# EAGLE design TCS3200 (EAGLE 7.6.0)
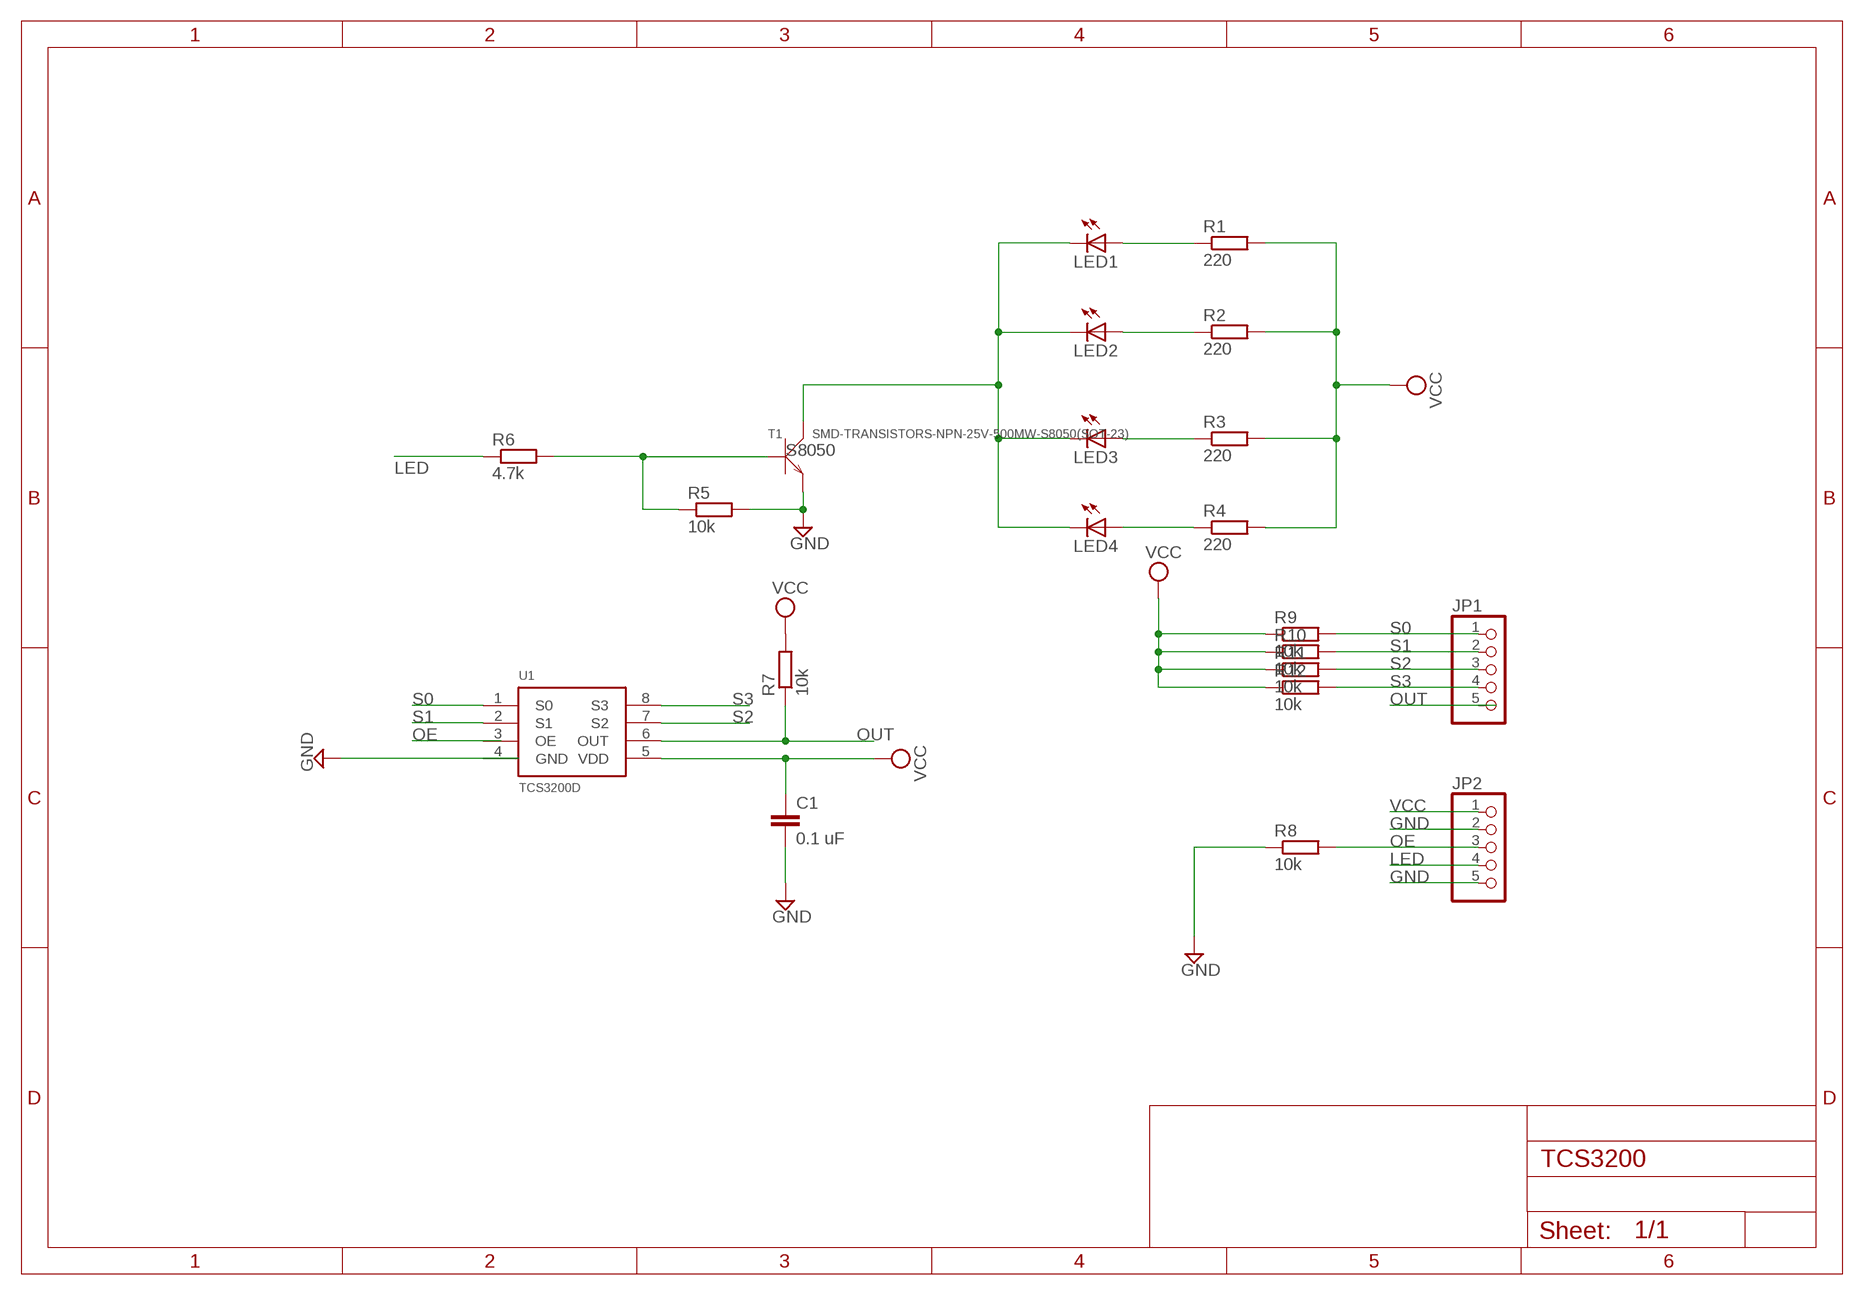
[diagram p0: schematic, sheet 1]

## Parts
C1  0.1 uF  C-EUC3216  [C3216]
JP1  PINHD-1X5/90  [1X05/90]
JP2  PINHD-1X5/90  [1X05/90]
LED1  LEDSML1206  [SML1206]
LED2  LEDSML1206  [SML1206]
LED3  LEDSML1206  [SML1206]
LED4  LEDSML1206  [SML1206]
R1  220  R-EU_R2012W  [R2012W]
R2  220  R-EU_R2012W  [R2012W]
R3  220  R-EU_R2012W  [R2012W]
R4  220  R-EU_R2012W  [R2012W]
R5  10k  R-EU_R2012W  [R2012W]
R6  4.7k  R-EU_R2012W  [R2012W]
R7  10k  R-EU_R2012W  [R2012W]
R8  10k  R-EU_R2012W  [R2012W]
R9  10k  R-EU_R2012W  [R2012W]
R10  10k  R-EU_R2012W  [R2012W]
R11  10k  R-EU_R2012W  [R2012W]
R12  10k  R-EU_R2012W  [R2012W]
T1  SMD-TRANSISTORS-NPN-25V-500MW-S8050(SOT-23)  [SOT-23]
U1  TCS3200D  [SOIC8]

## Nets
GND: C1.2 JP2.2 JP2.5 R5.2 R8.1 T1.2(E)
LED: JP2.4 R6.1
N$1: LED1.A R1.1
N$2: LED2.A R2.1
N$3: LED3.A R3.1
N$4: LED4.A R4.1
N$6: LED1.C LED2.C LED3.C LED4.C T1.3(C)
N$7: R5.1 R6.2 T1.1(B)
OE: JP2.3 R8.2
OUT: R7.1 U1.6(OUT)
S0: JP1.1 R9.2 U1.1(S0)
S1: JP1.2 R10.2
S2: JP1.3 R11.2 U1.7(S2)
S3: JP1.4 R12.2 U1.8(S3)
VCC: C1.1 JP2.1 R1.2 R2.2 R3.2 R4.2 R7.2 R9.1 R10.1 R11.1 R12.1 U1.5(VDD)
Unconnected: JP1.5 U1.2(S1) U1.3(OE) U1.4(GND)

## Library data of the parts
C1 = rcl:C-EU: CAPACITOR, European symbol
JP1 JP2 = pinhead:PINHD-1X5: PIN HEADER
LED1-LED4 = led:LED: LED OSRAM: - CHIPLED LG R971, LG N971, LY N971, LG Q971, LY Q971, LO R971, LY R971 LH N974, LH R974 LS Q976, LO Q976, LY Q976 LO Q996 - Hyper CHIPLED LW Q18S LB Q993, LB Q99A, LB R99A - SideLED LS A670, LO A670, LY A670, LG A670, LP A670 LB A673, LV A673, LT A673, LW A673 LH A674 LY A675 LS A676, LA A676, LO A676, LY A676, LW A676 LS A679, LY A679, LG A679 - Hyper Micro SIDELED® LS Y876, LA Y876, LO Y876, LY Y876 LT Y87S - SmartLED LW L88C, LW L88S LB L89C, LB L89S, LG L890 LS L89K, LO L89K, LY L89K LS L896, LA L896, LO L896, LY L896 - TOPLED LS T670, LO T670, LY T670, LG T670, LP T670 LSG T670, LSP T670, LSY T670, LOP T670, LYG T670 LG T671, LOG T671, LSG T671 LB T673, LV T673, LT T673, LW T673 LH T674 LS T676, LA T676, LO T676, LY T676, LB T676, LH T676, LSB T676, LW T676 LB T67C, LV T67C, LT T67C, LS T67K, LO T67K, LY T67K, LW E67C LS E67B, LA E67B, LO E67B, LY E67B, LB E67C, LV E67C, LT E67C LW T67C LS T679, LY T679, LG T679 LS T770, LO T770, LY T770, LG T770, LP T770 LB T773, LV T773, LT T773, LW T773 LH T774 LS E675, LA E675, LY E675, LS T675 LS T776, LA T776, LO T776, LY T776, LB T776 LHGB T686 LT T68C, LB T68C - Hyper Mini TOPLED® LB M676 - Mini TOPLED Santana® LG M470 LS M47K, LO M47K, LY M47K Source: http://www.osram.convergy.de LUXEON: - LUMILED® LXK2-PW12-R00, LXK2-PW12-S00, LXK2-PW14-U00, LXK2-PW14-V00 LXK2-PM12-R00, LXK2-PM12-S00, LXK2-PM14-U00 LXK2-PE12-Q00, LXK2-PE12-R00, LXK2-PE12-S00, LXK2-PE14-T00, LXK2-PE14-U00 LXK2-PB12-K00, LXK2-PB12-L00, LXK2-PB12-M00, LXK2-PB14-N00, LXK2-PB14-P00, LXK2-PB14-Q00 LXK2-PR12-L00, LXK2-PR12-M00, LXK2-PR14-Q00, LXK2-PR14-R00 LXK2-PD12-Q00, LXK2-PD12-R00, LXK2-PD12-S00 LXK2-PH12-R00, LXK2-PH12-S00 LXK2-PL12-P00, LXK2-PL12-Q00, LXK2-PL12-R00 Source: www.luxeon.com KINGBRIGHT: KA-3528ASYC Source: www.kingbright.com
R1 = rcl:R-EU_: RESISTOR, European symbol; R1: 220
R2-R12 = rcl:R-EU_: RESISTOR, European symbol
T1 = SMD-TRANSISTORS-NPN-25V-500MW-S8050_SOT-23_:SMD-TRANSISTORS-NPN-25V-500MW-S8050(SOT-23): 305010017; AVAILABILITY: Unavailable; DESCRIPTION: SMD Transistors NPN 25V-500mW;; MF: JCET; MP: S8050; PACKAGE: SOT-23-3 JCET; PRICE: None
U1 = TCS3200D:TCS3200D; AVAILABILITY: Unavailable; DESCRIPTION: Sensor, Light and Colour to Frequency; MF: RS Components; MP: TCS3200D; PACKAGE: None; PRICE: None

## Board
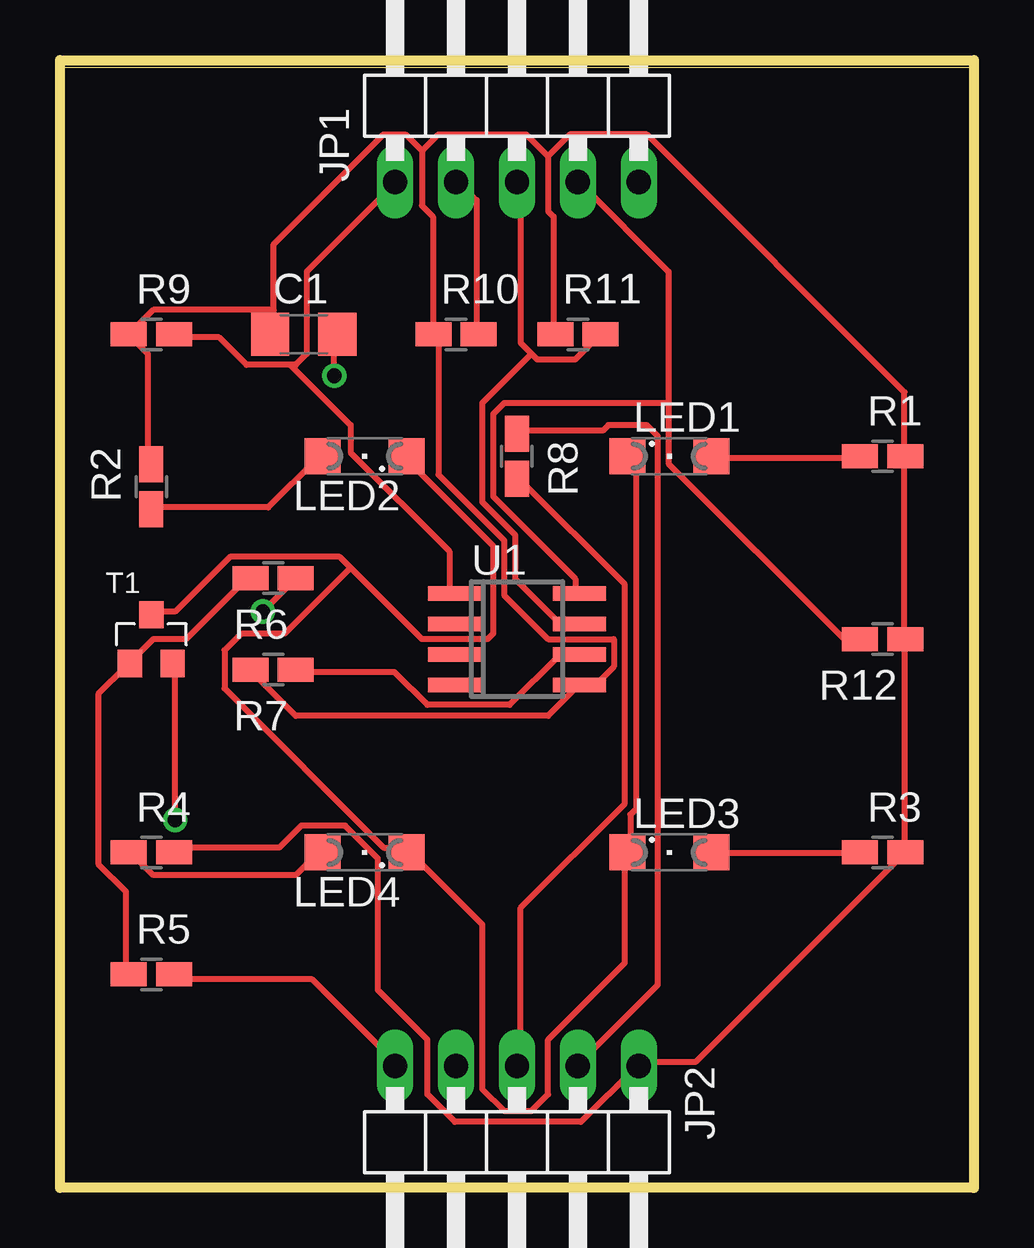
[diagram p1: board, top side]
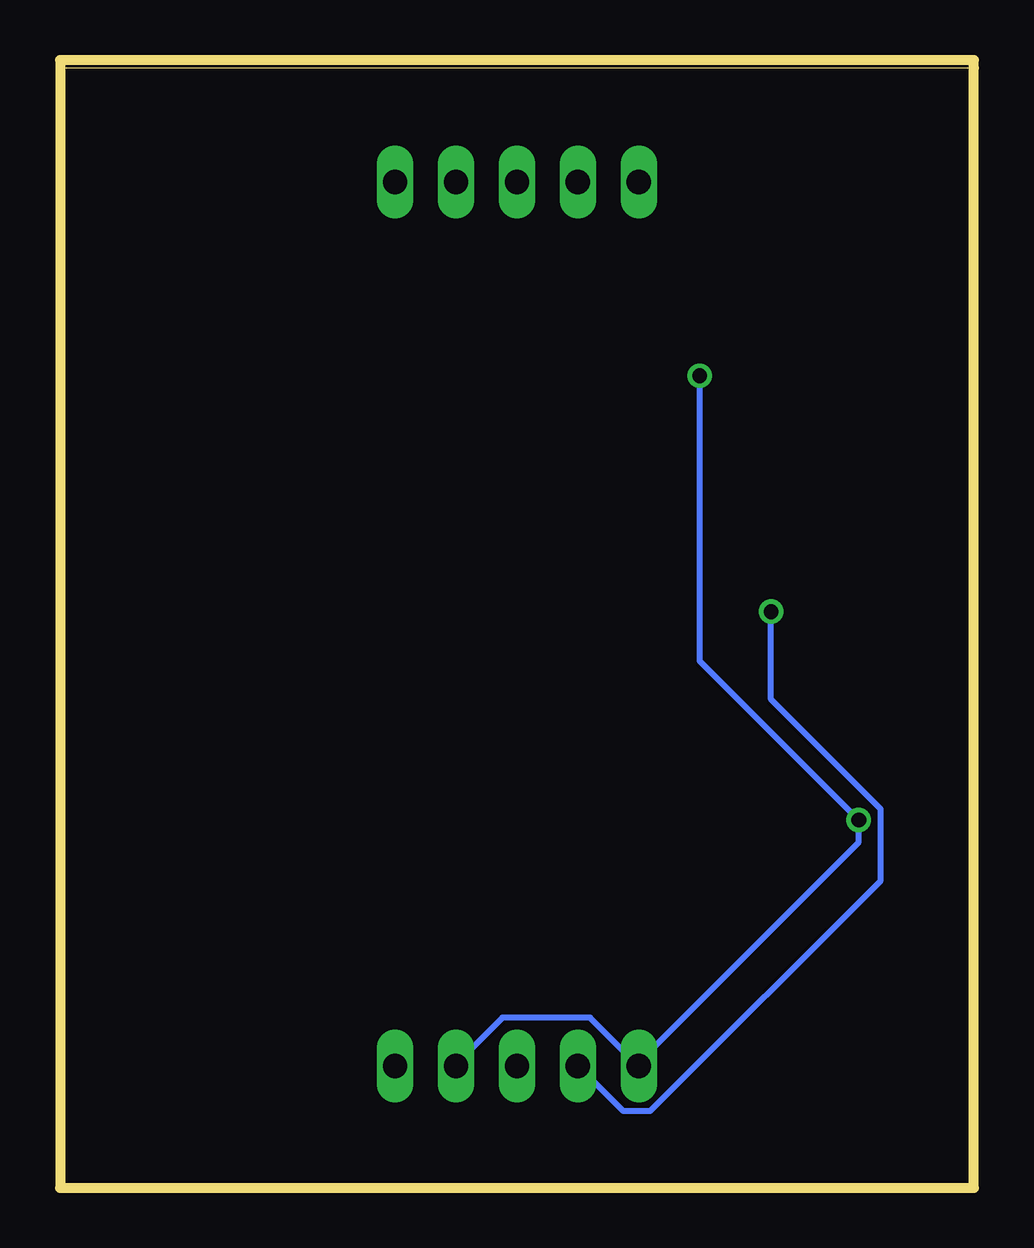
[diagram p2: board, bottom side, seen from below]

Size 38.1 x 46.99 mm. Coordinates in mm from the lower left corner, seen from the top.
Outline: 38.08,0 38.08,46.66 0,46.66
Outline: 0,46.66 0,0 38.08,0
Outline: 0,46.66 0,46.99 38.1,46.99 38.1,0 38.08,0
Copper layers (1*16): Top 0.035mm / dielectric 1.5mm / Bottom 0.035mm
Design rules "default": minimum track width 10mil, minimum drill 24mil, track to track 8mil, track to pad 8mil, pad to pad 8mil, via to via 8mil, smd to smd 8mil, copper to edge 40mil, drill to drill 8mil, minimum pad ring 10mil, minimum via ring 8mil, stop-mask expansion 4mil, vias tented up to drill 0mil, thermal gap 10mil

### Footprints (pad centres in the part's own frame; a part is rotated, then mirrored left to right if it is on the bottom)
C3216 = smd 1.6 x 1.8: 1 -1.4,0; 2 1.4,0
1X05/90 = drill 1.016 long: 1 -5.08,-3.81; 2 -2.54,-3.81; 3 0,-3.81; 4 2.54,-3.81; 5 5.08,-3.81
SML1206 = smd 1.5 x 1.5: A 1.75,0; C -1.75,0
R2012W = smd 1.5 x 1: 1 -0.94,0; 2 0.94,0
SOT-23 = smd 1.016 x 1.143: 1 -0.889,-1.016; 2 0.889,-1.016; 3 0,1.016
SOIC8 = smd 2.2 x 0.6: 1 -2.6,1.905; 2 -2.6,0.635; 3 -2.6,-0.635; 4 -2.6,-1.905; 5 2.6,-1.905; 6 2.6,-0.635; 7 2.6,0.635; 8 2.6,1.905

### Placement (x,y rotation side)
C1  10.16,35.56 0 top
JP1  19.05,45.72 0 top
JP2  19.05,1.27 180 top
LED1  25.4,30.48 0 top
LED2  12.7,30.48 180 top
LED3  25.4,13.97 0 top
LED4  12.7,13.97 180 top
R1  34.29,30.48 0 top
R2  3.81,29.21 90 top
R3  34.29,13.97 0 top
R4  3.81,13.97 0 top
R5  3.81,8.89 0 top
R6  8.89,25.4 180 top
R7  8.89,21.59 180 top
R8  19.05,30.48 270 top
R9  3.81,35.56 0 top
R10  16.51,35.56 0 top
R11  21.59,35.56 0 top
R12  34.29,22.86 180 top
T1  3.81,22.86 0 top
U1  19.05,22.86 0 top

### Tracks (layer width: path | path; a pad name or v marks a point on that pad's centre or on a via)
GND  (via drill 0.61)
  Top 0.254: R8.1 19.2,31.55 22.63,31.55 22.86,31.77 24.46,31.77 24.92,31.32 24.92,8.46 21.72,5.26 JP2.2 | v4.8,15.32 4.8,21.72 T1.2 | R5.2 4.8,8.69 10.52,8.69 13.95,5.26 JP2.5 | v11.43,33.83 11.43,35.43 C1.2
  Bottom 0.254: v11.43,33.83 11.43,21.95 v4.8,15.32 4.8,14.4 13.95,5.26 JP2.5 14.17,5.26 16,7.09 19.66,7.09 21.49,5.26 JP2.2
LED  (via drill 0.61)
  Top 0.254: v8.46,24 9.83,25.38 R6.1
  Bottom 0.254: v8.46,24 8.46,20.34 3.89,15.77 3.89,12.8 13.49,3.2 14.63,3.2 JP2.4
N$1
  Top 0.254: LED1.A 27.2,30.4 33.15,30.4 R1.1
N$2
  Top 0.254: R2.1 3.89,28.35 8.69,28.35 10.74,30.4 LED2.A
N$3
  Top 0.254: LED3.A 27.2,13.95 33.15,13.95 R3.1
N$4
  Top 0.254: R4.1 2.97,13.95 3.89,13.03 9.83,13.03 10.74,13.95 LED4.A
N$6
  Top 0.254: LED1.C 23.77,30.4 24,30.18 24,15.77 23.77,15.54 23.77,14.17 LED3.C 23.55,13.95 23.55,9.37 20.34,6.17 20.34,3.89 19.66,3.2 18.52,3.2 17.6,4.12 17.6,10.97 14.63,13.95 LED4.C 14.4,14.17 13.49,14.17 6.86,20.8 6.86,22.4 7.54,23.09 9.37,23.09 12.12,25.83 | 12.12,25.83 15.09,22.86 17.83,22.86 18.06,23.09 18.06,26.75 14.4,30.4 LED2.C | 12.12,25.83 11.66,26.29 7.09,26.29 4.8,24 3.89,24 T1.3
N$7
  Top 0.254: R6.2 7.77,25.38 5.26,22.86 3.89,22.86 2.97,21.95 T1.1 2.74,21.72 1.6,20.57 1.6,13.49 2.74,12.34 2.74,8.91 R5.1
OE
  Top 0.254: R8.2 19.2,29.49 23.55,25.15 23.55,16 19.2,11.66 19.2,5.26 JP2.3
OUT
  Top 0.254: R7.1 10.06,21.49 13.95,21.49 15.32,20.12 18.75,20.12 20.8,22.17 21.49,22.17 U1.6
S0
  Top 0.254: 9.6,34.29 9.83,34.29 10.29,34.75 10.29,38.18 13.95,41.83 JP1.1 | 9.6,34.29 7.77,34.29 6.63,35.43 4.8,35.43 R9.2 | 9.6,34.29 12.12,31.77 12.12,30.63 16.23,26.52 16.23,24.92 U1.1
S1
  Top 0.254: R10.2 17.37,35.66 17.37,41.15 16.69,41.83 JP1.2
S2
  Top 0.254: 19.66,34.75 19.2,35.2 19.2,41.83 JP1.3 | 19.66,34.75 19.89,34.52 21.49,34.52 22.4,35.43 R11.2 | 19.66,34.75 17.6,32.69 17.6,28.57 18.97,27.2 18.97,25.38 20.8,23.55 21.49,23.55 U1.7
S3
  Top 0.254: R12.2 32.69,22.86 25.38,30.18 25.38,32.69 | 25.38,32.69 25.38,38.18 21.72,41.83 JP1.4 | 25.38,32.69 18.52,32.69 18.06,32.23 18.06,28.8 21.49,25.38 21.49,24.92 U1.8
VCC
  Top 0.254: R7.2 8,21.49 9.83,19.66 20.34,19.66 21.49,20.8 U1.5 21.72,21.03 22.4,21.03 23.09,21.72 23.09,22.86 20.34,22.86 18.52,24.69 18.52,26.98 15.77,29.72 15.77,35.43 R10.1 15.54,35.66 15.54,40.46 15.09,40.92 15.09,43.2 | R2.2 3.66,30.18 3.66,34.75 2.97,35.43 R9.1 2.97,35.66 3.89,36.58 8.91,36.58 | 15.09,43.2 14.4,43.89 13.49,43.89 8.91,39.32 8.91,36.58 | 8.91,36.58 8.91,35.66 C1.1 | 20.34,42.98 20.34,40.69 20.57,40.46 20.57,35.66 R11.1 | 20.34,42.98 19.43,43.89 15.77,43.89 15.09,43.2 | 35.2,22.86 35.2,14.17 R3.2 35.2,13.95 26.52,5.26 24.23,5.26 JP2.1 24,5.03 21.72,2.74 16.46,2.74 15.32,3.89 15.32,6.17 13.26,8.23 13.26,13.72 11.89,15.09 10.06,15.09 9.14,14.17 4.8,14.17 R4.2 | 35.2,22.86 35.2,30.4 R1.2 35.2,30.63 35.2,33.15 24.46,43.89 21.26,43.89 20.34,42.98 | 35.2,22.86 R12.1